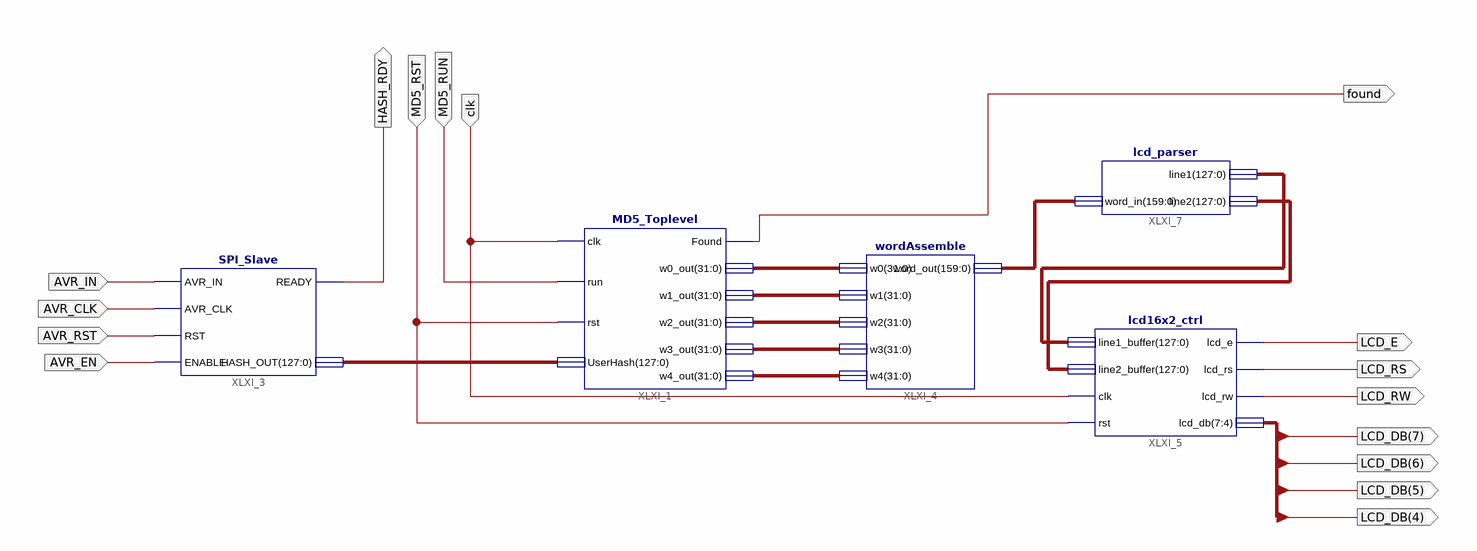
[diagram p0: schematic sheet 1]
// Xilinx ISE schematic Interface.sch (spartan3a) as structural Verilog: 5 symbols, 16 ports
module Interface (
  input  AVR_IN,
  input  AVR_CLK,
  input  AVR_RST,
  input  AVR_EN,
  input  MD5_RST,
  input  MD5_RUN,
  input  clk,
  output found,
  output HASH_RDY,
  output [7:4] LCD_DB,
  output LCD_RW,
  output LCD_RS,
  output LCD_E
);

  wire [31:0] w0, w1, w2, w3, w4;
  wire [127:0] UserHash, XLXN_3, XLXN_4;
  wire [159:0] XLXN_2;

  SPI_Slave XLXI_3 (
    .AVR_IN(AVR_IN), .AVR_CLK(AVR_CLK), .RST(AVR_RST), .ENABLE(AVR_EN), .READY(HASH_RDY), .HASH_OUT(UserHash));
  MD5_Toplevel XLXI_1 (
    .clk(clk), .run(MD5_RUN), .rst(MD5_RST), .UserHash(UserHash), .Found(found), .w0_out(w0), .w1_out(w1),
    .w2_out(w2), .w3_out(w3), .w4_out(w4));
  wordAssemble XLXI_4 (.w0(w0), .w1(w1), .w2(w2), .w3(w3), .w4(w4), .word_out(XLXN_2));
  lcd16x2_ctrl XLXI_5 (
    .lcd_e(LCD_E), .lcd_rs(LCD_RS), .lcd_rw(LCD_RW), .lcd_db(LCD_DB), .line1_buffer(XLXN_4),
    .line2_buffer(XLXN_3), .clk(clk), .rst(MD5_RST));
  lcd_parser XLXI_7 (.word_in(XLXN_2), .line1(XLXN_4), .line2(XLXN_3));
endmodule
